# Altium project A5000_BasicBackplane.PrjPcb
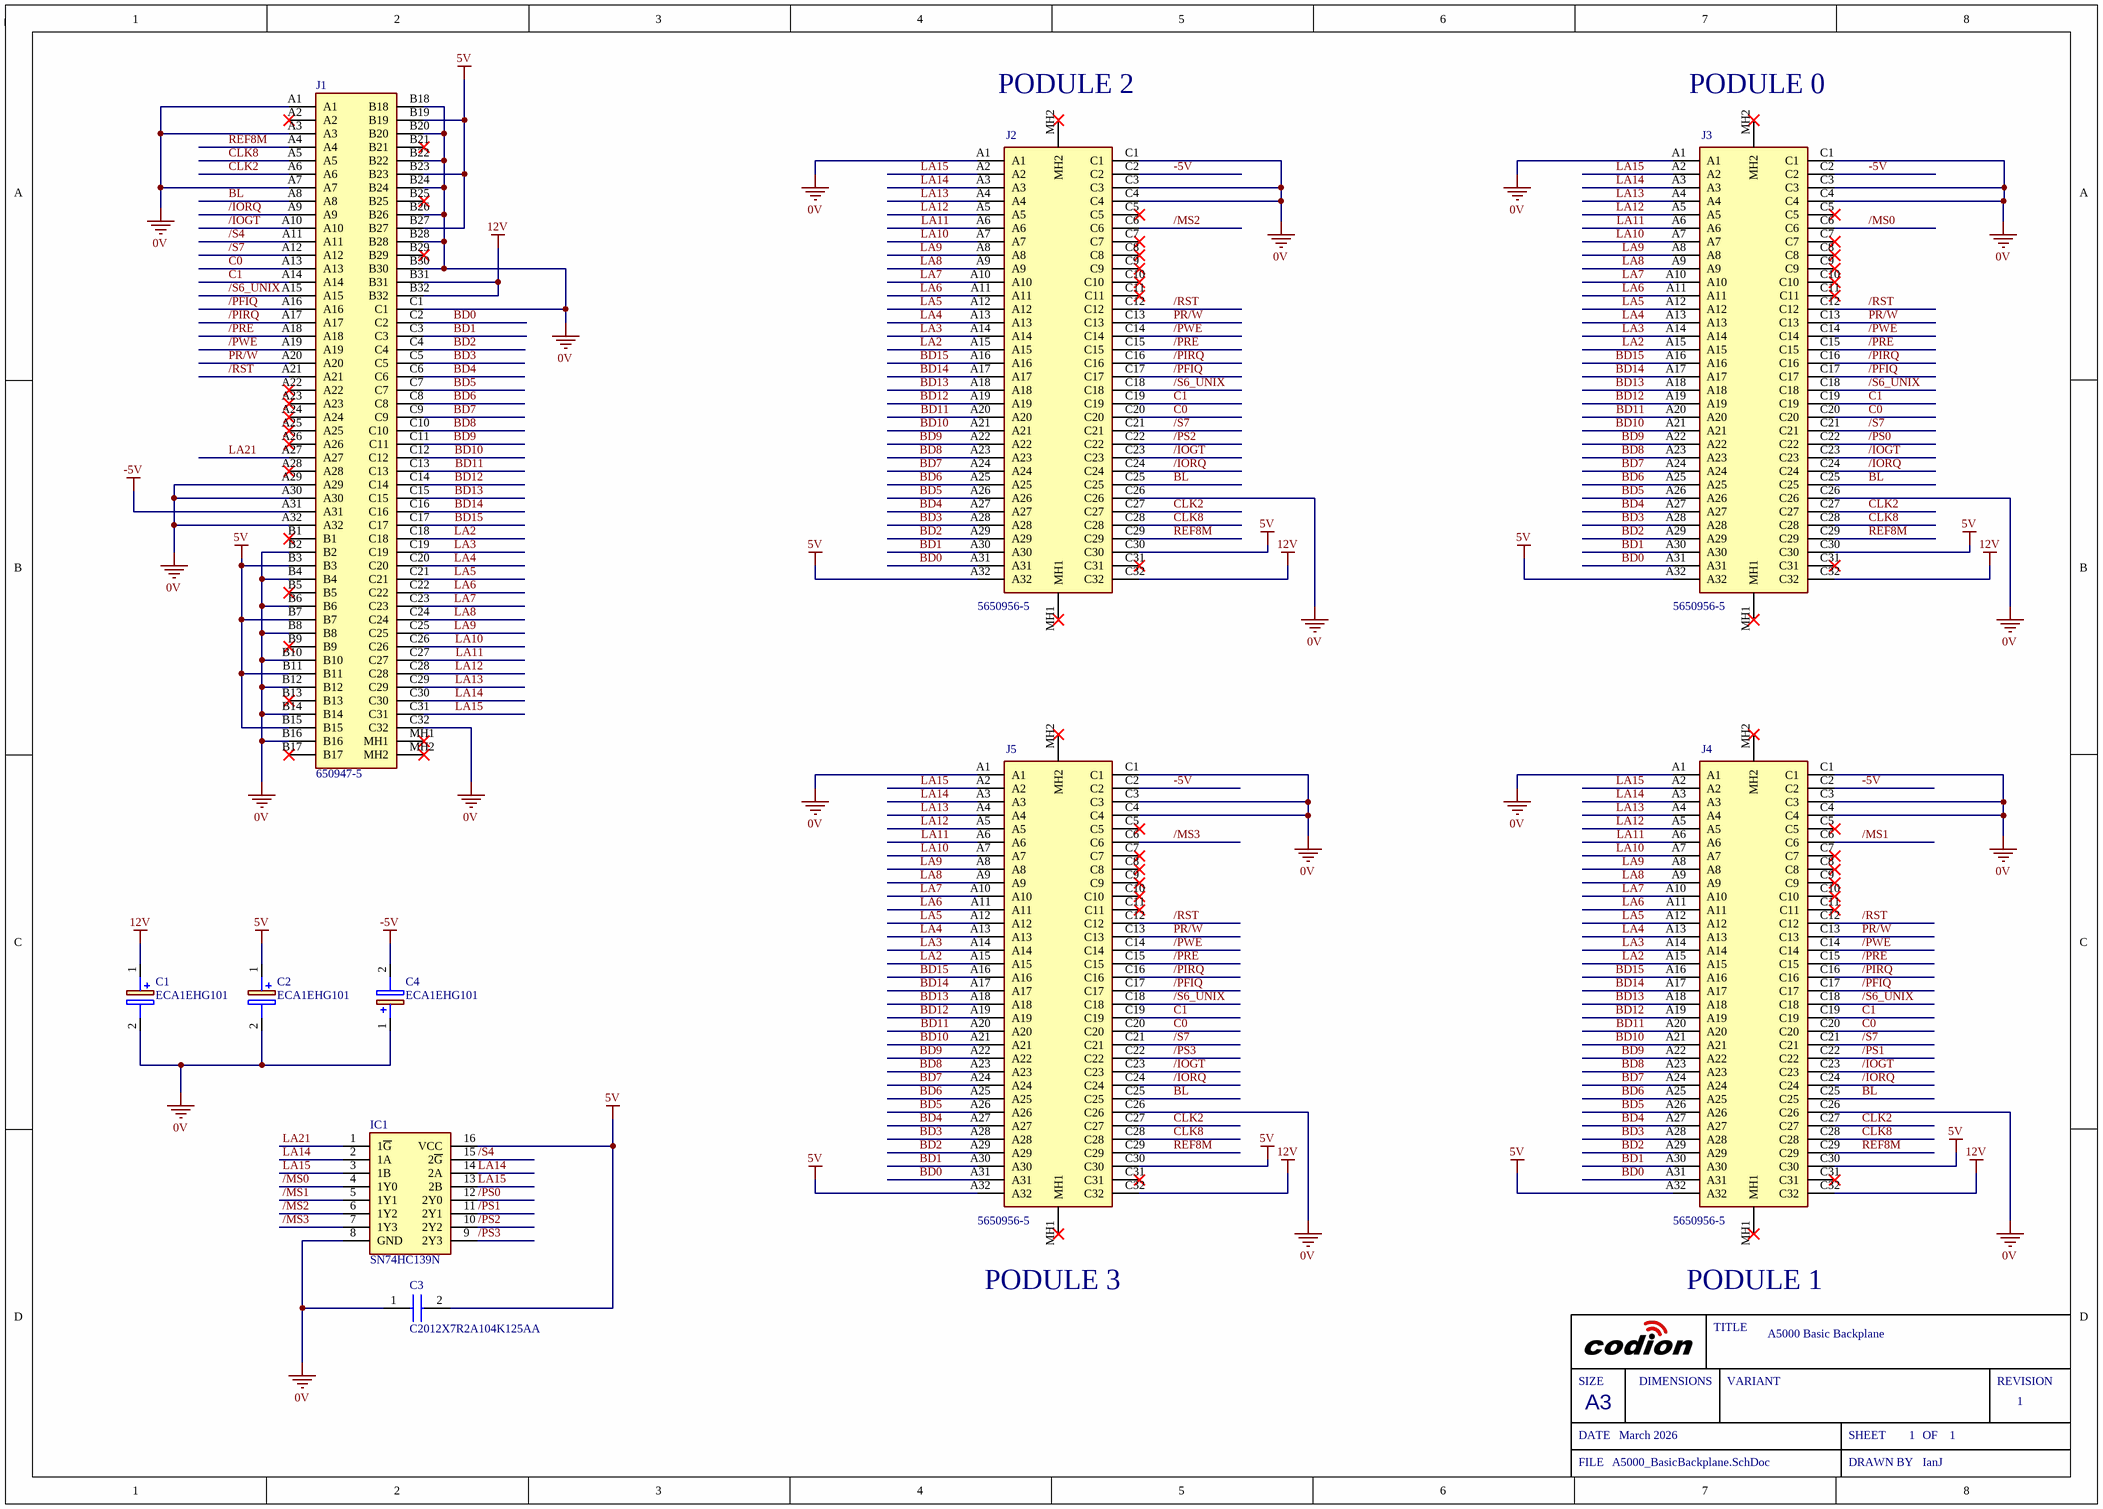
[diagram p0: A5000_BasicBackplane.SchDoc]
DrawnBy: IanJ; Project_Title: A5000 Basic Backplane; Sch_ReleaseDate: March 2026; Sch_RevNo: 1
1 sheet, 10 parts. Net scope: global (net labels, ports and power ports of the same name join across sheets).
Board file: A5000_BasicBackplane.PcbDoc

## Sheet A5000_BasicBackplane.SchDoc
size A3; SheetNumber: 1; SheetTotal: 1

### Parts
C1  ECA1EHG101  [CAPPRD250W55D630H1220]
C2  ECA1EHG101  [CAPPRD250W55D630H1220]
C3  C2012X7R2A104K125AA  [CAPC2012X145N]
C4  ECA1EHG101  [CAPPRD250W55D630H1220]
IC1  SN74HC139N  [DIP794W53P254L1930H508Q16N]
J1  650947-5  [6509475]
J2  5650956-5  [56509565]
J3  5650956-5  [56509565]
J4  5650956-5  [56509565]
J5  5650956-5  [56509565]

### Nets
0V: C1.2(-) C2.2(-) C3.1 C4.1(+) IC1.8(GND) J1.A1 J1.A3 J1.A7 J1.A29 J1.A30 J1.A32 J1.B2 J1.B4 J1.B6 J1.B8 J1.B10 J1.B12 J1.B14 J1.B16 J1.B18 J1.B20 J1.B22 J1.B24 J1.B26 J1.B28 J1.B30 J1.C1 J1.C32 J2.A1 J2.C1 J2.C3 J2.C4 J2.C26 J3.A1 J3.C1 J3.C3 J3.C4 J3.C26 J4.A1 J4.C1 J4.C3 J4.C4 J4.C26 J5.A1 J5.C1 J5.C3 J5.C4 J5.C26
5V: C2.1(+) C3.2 IC1.16(VCC) J1.B3 J1.B7 J1.B11 J1.B15 J1.B19 J1.B23 J1.B27 J2.A32 J2.C30 J3.A32 J3.C30 J4.A32 J4.C30 J5.A32 J5.C30
12V: C1.1(+) J1.B31 J1.B32 J2.C32 J3.C32 J4.C32 J5.C32
-5V: C4.2(-) J1.A31 J2.C2 J3.C2 J4.C2 J5.C2
/IOGT: J1.A10 J2.C23 J3.C23 J4.C23 J5.C23
/IORQ: J1.A9 J2.C24 J3.C24 J4.C24 J5.C24
/MS0: IC1.4(1Y0) J3.C6
/MS1: IC1.5(1Y1) J4.C6
/MS2: IC1.6(1Y2) J2.C6
/MS3: IC1.7(1Y3) J5.C6
/PFIQ: J1.A16 J2.C17 J3.C17 J4.C17 J5.C17
/PIRQ: J1.A17 J2.C16 J3.C16 J4.C16 J5.C16
/PRE: J1.A18 J2.C15 J3.C15 J4.C15 J5.C15
/PS0: IC1.12(2Y0) J3.C22
/PS1: IC1.11(2Y1) J4.C22
/PS2: IC1.10(2Y2) J2.C22
/PS3: IC1.9(2Y3) J5.C22
/PWE: J1.A19 J2.C14 J3.C14 J4.C14 J5.C14
/RST: J1.A21 J2.C12 J3.C12 J4.C12 J5.C12
/S4: IC1.15(2~{G}) J1.A11
/S6_UNIX: J1.A15 J2.C18 J3.C18 J4.C18 J5.C18
/S7: J1.A12 J2.C21 J3.C21 J4.C21 J5.C21
BD0: J1.C2 J2.A31 J3.A31 J4.A31 J5.A31
BD1: J1.C3 J2.A30 J3.A30 J4.A30 J5.A30
BD2: J1.C4 J2.A29 J3.A29 J4.A29 J5.A29
BD3: J1.C5 J2.A28 J3.A28 J4.A28 J5.A28
BD4: J1.C6 J2.A27 J3.A27 J4.A27 J5.A27
BD5: J1.C7 J2.A26 J3.A26 J4.A26 J5.A26
BD6: J1.C8 J2.A25 J3.A25 J4.A25 J5.A25
BD7: J1.C9 J2.A24 J3.A24 J4.A24 J5.A24
BD8: J1.C10 J2.A23 J3.A23 J4.A23 J5.A23
BD9: J1.C11 J2.A22 J3.A22 J4.A22 J5.A22
BD10: J1.C12 J2.A21 J3.A21 J4.A21 J5.A21
BD11: J1.C13 J2.A20 J3.A20 J4.A20 J5.A20
BD12: J1.C14 J2.A19 J3.A19 J4.A19 J5.A19
BD13: J1.C15 J2.A18 J3.A18 J4.A18 J5.A18
BD14: J1.C16 J2.A17 J3.A17 J4.A17 J5.A17
BD15: J1.C17 J2.A16 J3.A16 J4.A16 J5.A16
BL: J1.A8 J2.C25 J3.C25 J4.C25 J5.C25
C0: J1.A13 J2.C20 J3.C20 J4.C20 J5.C20
C1: J1.A14 J2.C19 J3.C19 J4.C19 J5.C19
CLK2: J1.A6 J2.C27 J3.C27 J4.C27 J5.C27
CLK8: J1.A5 J2.C28 J3.C28 J4.C28 J5.C28
LA2: J1.C18 J2.A15 J3.A15 J4.A15 J5.A15
LA3: J1.C19 J2.A14 J3.A14 J4.A14 J5.A14
LA4: J1.C20 J2.A13 J3.A13 J4.A13 J5.A13
LA5: J1.C21 J2.A12 J3.A12 J4.A12 J5.A12
LA6: J1.C22 J2.A11 J3.A11 J4.A11 J5.A11
LA7: J1.C23 J2.A10 J3.A10 J4.A10 J5.A10
LA8: J1.C24 J2.A9 J3.A9 J4.A9 J5.A9
LA9: J1.C25 J2.A8 J3.A8 J4.A8 J5.A8
LA10: J1.C26 J2.A7 J3.A7 J4.A7 J5.A7
LA11: J1.C27 J2.A6 J3.A6 J4.A6 J5.A6
LA12: J1.C28 J2.A5 J3.A5 J4.A5 J5.A5
LA13: J1.C29 J2.A4 J3.A4 J4.A4 J5.A4
LA14: IC1.2(1A) IC1.14(2A) J1.C30 J2.A3 J3.A3 J4.A3 J5.A3
LA15: IC1.3(1B) IC1.13(2B) J1.C31 J2.A2 J3.A2 J4.A2 J5.A2
LA21: IC1.1(1~{G}) J1.A27
PR/W: J1.A20 J2.C13 J3.C13 J4.C13 J5.C13
REF8M: J1.A4 J2.C29 J3.C29 J4.C29 J5.C29

Not connected (* = marked no-connect by the designer): J1 A2* A22* A23* A24* A25* A26* A28* B1* B5* B9* B13* B17* B21* B25* B29* MH1* MH2*; J2 C5* C7* C8* C9* C10* C11* C31* MH1* MH2*; J3 C5* C7* C8* C9* C10* C11* C31* MH1* MH2*; J4 C5* C7* C8* C9* C10* C11* C31* MH1* MH2*; J5 C5* C7* C8* C9* C10* C11* C31* MH1* MH2*

### Notes on the sheet
- (near J2) PODULE 2
- (near J3) PODULE 0
- PODULE 3
- PODULE 1
- SIZE
- DIMENSIONS
- TITLE
- VARIANT
- REVISION
- DATE
- A3
- SHEET
- OF
- FILE
- DRAWN BY

### Library data of the parts
C1 C2 C4 = ECA1EHG101: Capacitor Polarised; Manufacturer_Name: Panasonic; Datasheet Link: http://industrial.panasonic.com/cdbs/www-data/pdf/RDF0000/ABA0000C1215.pdf; Height: 12.2mm; Manufacturer_Part_Number: ECA1EHG101
C3 = C2012X7R2A104K125AA: Capacitor; Manufacturer_Name: TDK; Datasheet Link: https://product.tdk.com/info/en/catalog/datasheets/mlcc_commercial_midvoltage_en.pdf; Height: 1.45mm; Manufacturer_Part_Number: C2012X7R2A104K125AA; Mouser Part Number: 810-C2012X7R2A104K; Mouser Price/Stock: https://www.mouser.co.uk/ProductDetail/TDK/C2012X7R2A104K125AA?qs=NRhsANhppD9J0ZsT2%2Fo%2F7Q%3D%3D; Arrow Part Number: C2012X7R2A104K125AA; Arrow Price/Stock: https://www.arrow.com/en/products/c2012x7r2a104k125aa/tdk
IC1 = SN74HC139N: Integrated Circuit; Manufacturer_Name: Texas Instruments; Datasheet Link: http://www.ti.com/lit/gpn/sn74hc139; Height: 5.08mm; Manufacturer_Part_Number: SN74HC139N; Mouser Part Number: 595-SN74HC139N; Mouser Price/Stock: https://www.mouser.co.uk/ProductDetail/Texas-Instruments/SN74HC139N/?qs=DcvZ7Fltd5wMzlxyLmVDxw%3D%3D; Arrow Part Number: SN74HC139N; Arrow Price/Stock: https://www.arrow.com/en/products/sn74hc139n/texas-instruments
J1 = 650947-5: Connector; Manufacturer_Name: TE Connectivity; Datasheet Link: http://www.te.com/commerce/DocumentDelivery/DDEController?Action=srchrtrv&DocNm=650947&DocType=Customer+Drawing&DocLang=English; Height: 11.1mm; Manufacturer_Part_Number: 650947-5; Mouser Part Number: 571-6509475; Mouser Price/Stock: https://www.mouser.co.uk/ProductDetail/TE-Connectivity/650947-5?qs=A%252B%2FNCR0PvNW83cU5ePdpGw%3D%3D; Arrow Part Number: 650947-5; Arrow Price/Stock: https://www.arrow.com/en/products/650947-5/te-connectivity
J2-J5 = 5650956-5: Connector; Manufacturer_Name: TE Connectivity; Datasheet Link: https://componentsearchengine.com/Datasheets/2/5650956-5.pdf; Height: 11.51mm; Manufacturer_Part_Number: 5650956-5; Mouser Part Number: 571-5650956-5; Mouser Price/Stock: https://www.mouser.co.uk/ProductDetail/TE-Connectivity/5650956-5?qs=U4pz39agNJCw%2F9%252BN9Cdy%2Fg%3D%3D